# EAGLE schematic astable (EAGLE 7.1.0)
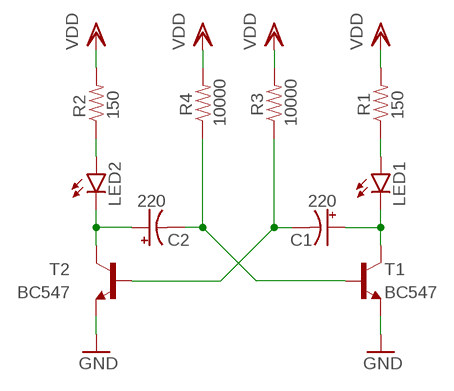
[diagram p0: schematic, sheet 1]

## Parts
C1  220  CAP_POLPTH4  [CPOL-RADIAL-1000UF-25V]
C2  220  CAP_POLPTH4  [CPOL-RADIAL-1000UF-25V]
LED1  LED5MM  [LED5MM]
LED2  LED5MM  [LED5MM]
R1  150  RESISTORPTH-1/2W  [AXIAL-0.5]
R2  150  RESISTORPTH-1/2W  [AXIAL-0.5]
R3  10000  RESISTORPTH-1/2W  [AXIAL-0.5]
R4  10000  RESISTORPTH-1/2W  [AXIAL-0.5]
T1  BC547  [TO92]
T2  BC547  [TO92]

## Nets
GND: T1.1(E) T2.1(E)
N$1: LED1.A R1.P$1
N$2: C1.1(+) LED1.K(C) T1.3(C)
N$3: C2.2(-) R4.P$1 T1.2(B)
N$4: LED2.A R2.P$1
N$5: C2.1(+) LED2.K(C) T2.3(C)
N$6: C1.2(-) R3.P$1 T2.2(B)
VDD: R1.P$2 R2.P$2 R3.P$2 R4.P$2

## Library data of the parts
C1 C2 = SparkFun-Passives:CAP_POL: Capacitor Polarized These are standard SMD and PTH capacitors. Normally 10uF, 47uF, and 100uF in electrolytic and tantalum varieties. Always verify the external diameter of the through hole cap, it varies with capacity, voltage, and manufacturer. The EIA devices should be standard.
LED1 LED2 = SparkFun-LED:LED: LEDs Standard schematic elements and footprints for 5mm, 3mm, 1206, and 0603 sized LEDs. 5mm - Spark Fun Electronics SKU : COM-00529 (and others)
R1-R4 = SparkFun-Passives:RESISTOR: Resistor Basic schematic elements and footprints for 0603, 1206, and PTH resistors.
T1 T2 = transistor:BC547: NPN TRANSISTOR